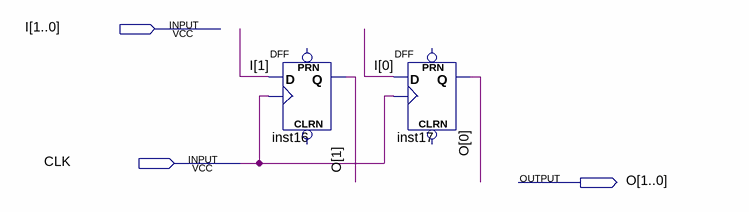
[diagram p0: schematic sheet]
// Quartus schematic Reg1x2.bdf as structural Verilog: 2 symbols, 3 pins
module Reg1x2 (
  input  [1:0] I,
  input  CLK,
  output [1:0] O
);

  DFF inst16 (.CLK(CLK), .D(I[1]), .Q(O[1]));  // open: CLRN, PRN
  DFF inst17 (.CLK(CLK), .D(I[0]), .Q(O[0]));  // open: CLRN, PRN
endmodule
